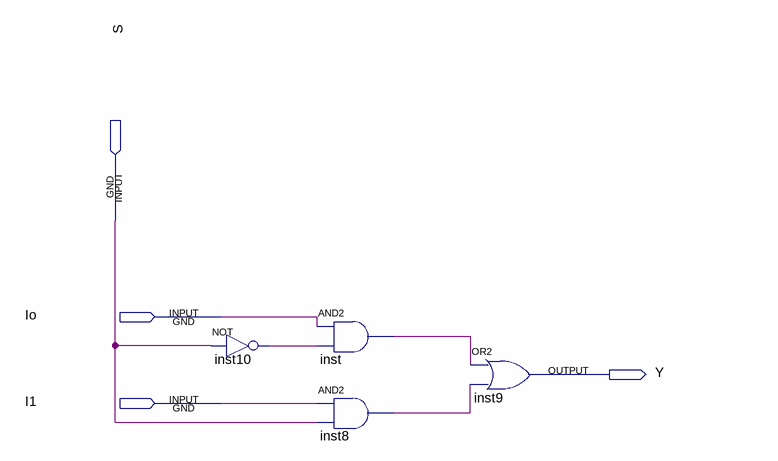
[diagram p0: schematic sheet]
// Quartus schematic mux21.bdf as structural Verilog: 4 symbols, 4 pins
module mux21 (
  input  S,
  input  Io,
  input  I1,
  output Y
);

  wire inst8_out, inst10_out, inst_out;

  not inst10 (inst10_out, S);
  and inst (inst_out, Io, inst10_out);
  and inst8 (inst8_out, I1, S);
  or inst9 (Y, inst_out, inst8_out);
endmodule
